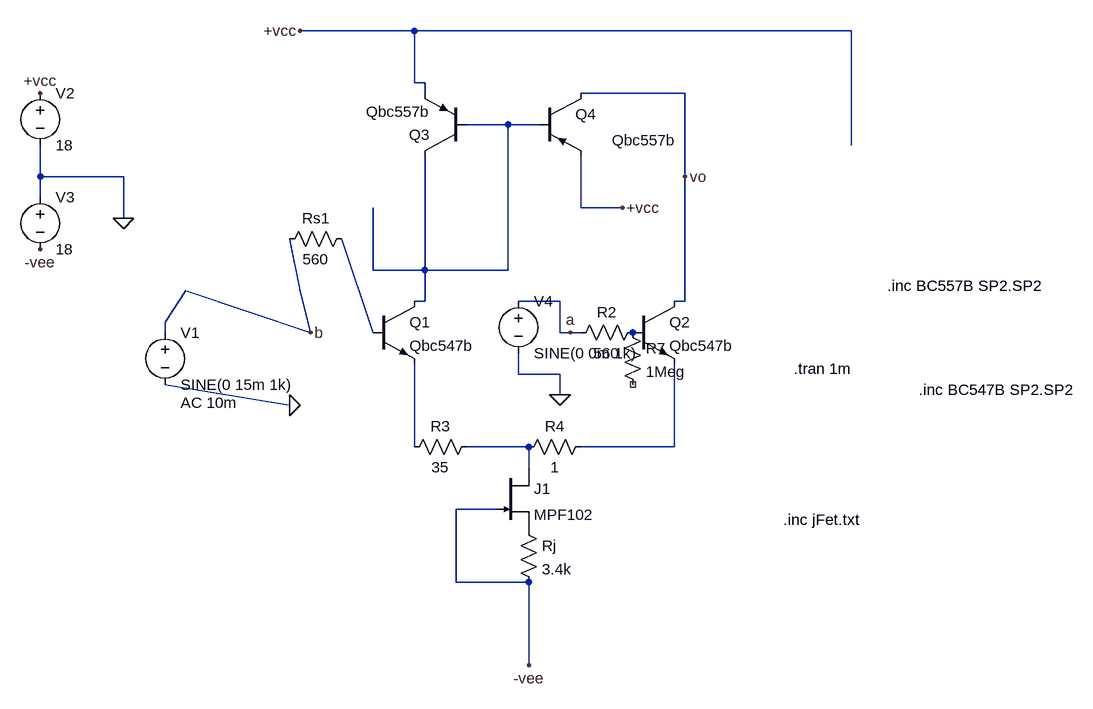
[diagram p0: schematic Eldiego.asc]
Eldiego.asc, the LTspice schematic file:
Version 4
SHEET 1 2088 828
WIRE 16 -288 -160 -288
WIRE 688 -288 16 -288
WIRE 16 -208 16 -288
WIRE 32 -208 16 -208
WIRE 32 -192 32 -208
WIRE 336 -192 272 -192
WIRE 432 -192 336 -192
WIRE 160 -144 96 -144
WIRE 208 -144 160 -144
WIRE 688 -112 688 -288
WIRE -560 -64 -560 -112
WIRE -432 -64 -560 -64
WIRE 432 -64 432 -192
WIRE 32 -48 32 -96
WIRE -560 -32 -560 -64
WIRE 272 -16 272 -96
WIRE 336 -16 272 -16
WIRE -432 0 -432 -64
WIRE -48 80 -48 -16
WIRE 32 80 32 -48
WIRE 32 80 -48 80
WIRE 160 80 160 -144
WIRE 160 80 32 80
WIRE -160 112 -176 32
WIRE 32 128 32 80
WIRE 32 128 16 128
WIRE 240 128 176 128
WIRE 432 128 432 -64
WIRE 432 128 416 128
WIRE -368 160 -336 112
WIRE -368 176 -368 160
WIRE -144 176 -336 112
WIRE -144 176 -160 112
WIRE -48 176 -96 32
WIRE 240 176 240 128
WIRE 256 176 240 176
WIRE 272 176 256 176
WIRE 176 240 176 208
WIRE 240 240 176 240
WIRE 16 272 16 224
WIRE 240 272 240 240
WIRE -176 288 -368 256
WIRE 16 352 16 272
WIRE 192 352 96 352
WIRE 416 352 416 224
WIRE 416 352 272 352
WIRE 192 384 192 352
WIRE 144 448 80 448
WIRE 80 560 80 448
WIRE 192 560 80 560
WIRE 192 688 192 560
FLAG 240 272 0
FLAG -160 -288 +vcc
FLAG 192 688 -vee
FLAG -432 0 0
FLAG -560 -192 +vcc
FLAG -560 48 -vee
FLAG 336 -16 +vcc
FLAG -176 288 0
FLAG 432 -64 vo
FLAG 256 176 a
FLAG -144 176 b
DATAFLAG 16 272 ""
DATAFLAG 16 -208 ""
DATAFLAG 336 -192 ""
DATAFLAG 32 -48 ""
SYMBOL npn -48 128 R0
SYMATTR InstName Q1
SYMATTR Value Qbc547b
SYMBOL npn 352 128 R0
SYMATTR InstName Q2
SYMATTR Value Qbc547b
SYMBOL pnp 96 -96 R180
SYMATTR InstName Q3
SYMATTR Value Qbc557b
SYMBOL pnp 208 -192 R0
WINDOW 3 112 72 Left 2
SYMATTR Value Qbc557b
SYMATTR InstName Q4
SYMBOL njf 144 384 R0
SYMATTR InstName J1
SYMATTR Value MPF102
SYMBOL res -80 16 R90
WINDOW 0 0 56 VBottom 2
WINDOW 3 32 56 VTop 2
SYMATTR InstName Rs1
SYMATTR Value 560
SYMBOL res 176 464 R0
SYMATTR InstName Rj
SYMATTR Value 3.4k
SYMBOL voltage -560 -208 R0
WINDOW 123 0 0 Left 2
WINDOW 39 0 0 Left 2
SYMATTR InstName V2
SYMATTR Value 18
SYMBOL voltage -560 -48 R0
SYMATTR InstName V3
SYMATTR Value 18
SYMBOL res 288 336 R90
WINDOW 0 0 56 VBottom 2
WINDOW 3 32 56 VTop 2
SYMATTR InstName R4
SYMATTR Value 1
SYMBOL voltage -368 160 R0
WINDOW 123 24 124 Left 2
WINDOW 39 0 0 Left 2
SYMATTR Value2 AC 10m
SYMATTR InstName V1
SYMATTR Value SINE(0 15m 1k)
SYMBOL res 368 160 R90
WINDOW 0 0 56 VBottom 2
WINDOW 3 32 56 VTop 2
SYMATTR InstName R2
SYMATTR Value 560
SYMBOL voltage 176 112 R0
WINDOW 123 0 0 Left 2
WINDOW 39 0 0 Left 2
SYMATTR InstName V4
SYMATTR Value SINE(0 0m 1k)
SYMBOL res 112 336 R90
WINDOW 0 0 56 VBottom 2
WINDOW 3 32 56 VTop 2
SYMATTR InstName R3
SYMATTR Value 35
SYMBOL res 336 160 R0
SYMATTR InstName R7
SYMATTR Value 1Meg
TEXT 584 464 Left 2 !.inc jFet.txt
TEXT 600 232 Left 2 !.tran 1m
TEXT 744 104 Left 2 !.inc BC557B SP2.SP2
TEXT 792 264 Left 2 !.inc BC547B SP2.SP2

The netlist it stands for:
* Eldiego.asc
Q1 N001 N002 N003 0 Qbc547b
Q2 vo P001 N005 0 Qbc547b
Q3 N001 N001 +vcc 0 Qbc557b
Q4 vo N001 +vcc 0 Qbc557b
J1 N004 -vee P002 MPF102
Rs1 N002 b 560
Rj P002 -vee 3.4k
V2 +vcc 0 18
V3 0 -vee 18
R4 N005 N004 1
V1 b 0 SINE(0 15m 1k) AC 10m
R2 P001 a 560
V4 a 0 SINE(0 0m 1k)
R3 N004 N003 35
R7 P001 NC_01 1Meg
.model NPN NPN
.model PNP PNP
.lib standard.bjt
.model NJF NJF
.model PJF PJF
.lib standard.jft
.inc jFet.txt
.tran 1m
.inc BC557B SP2.SP2
.inc BC547B SP2.SP2
.backanno
.end